# EAGLE design rf24-prueba12-F (EAGLE 9.6.2)
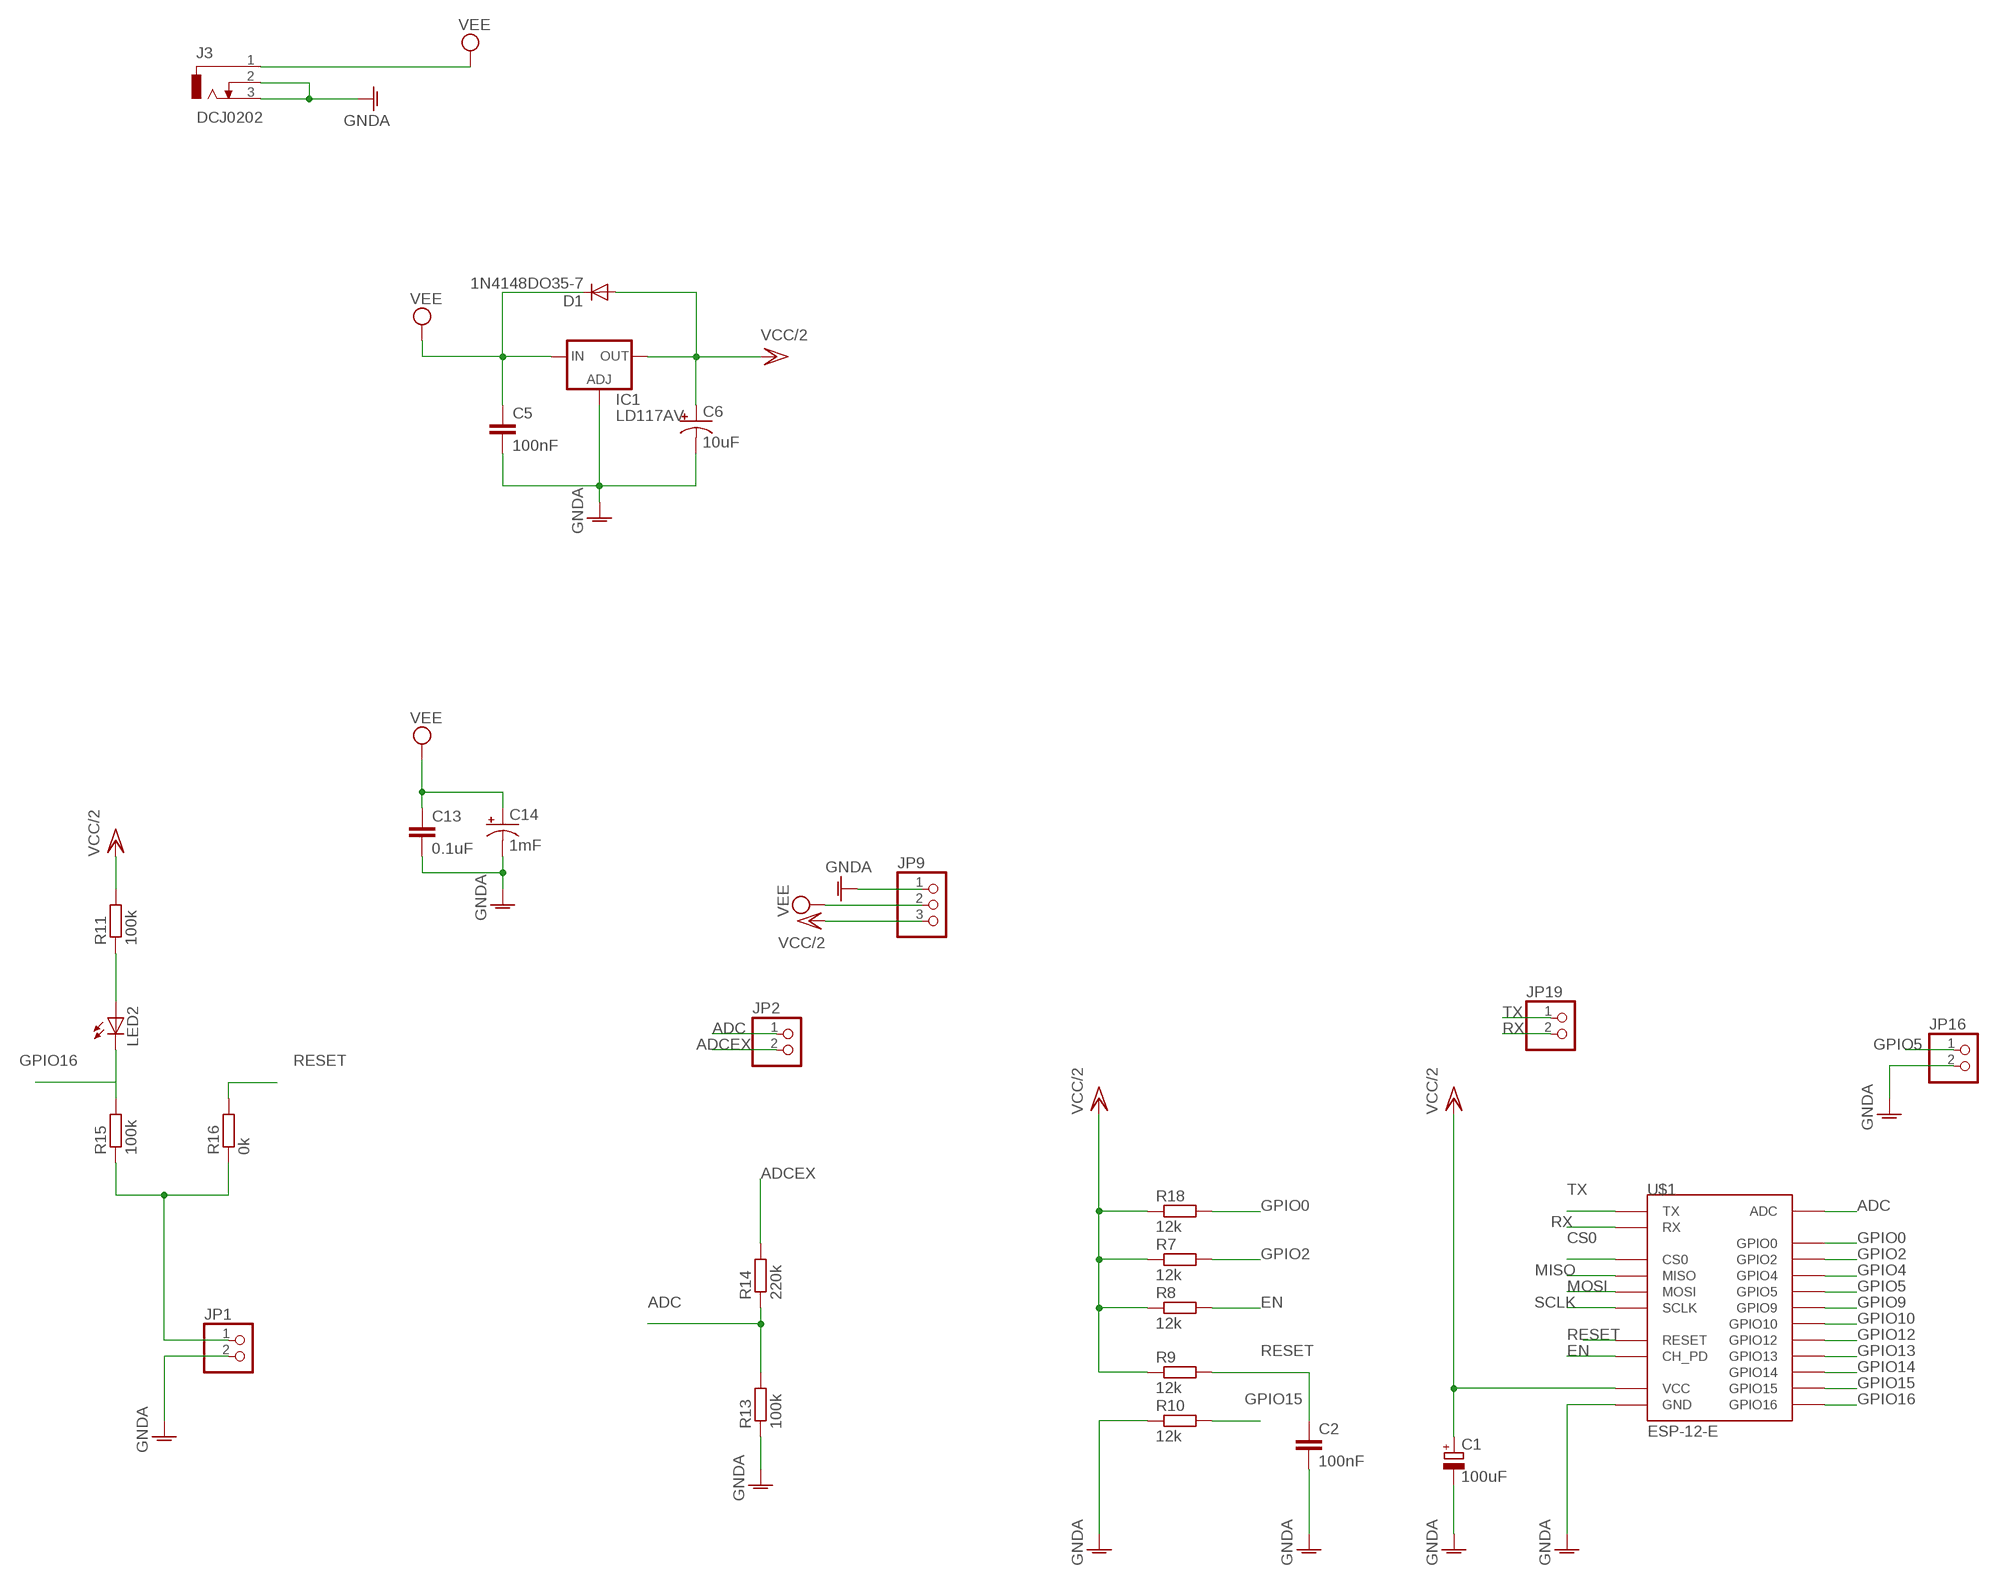
[diagram p0: schematic, sheet 1, part 1 of 2]
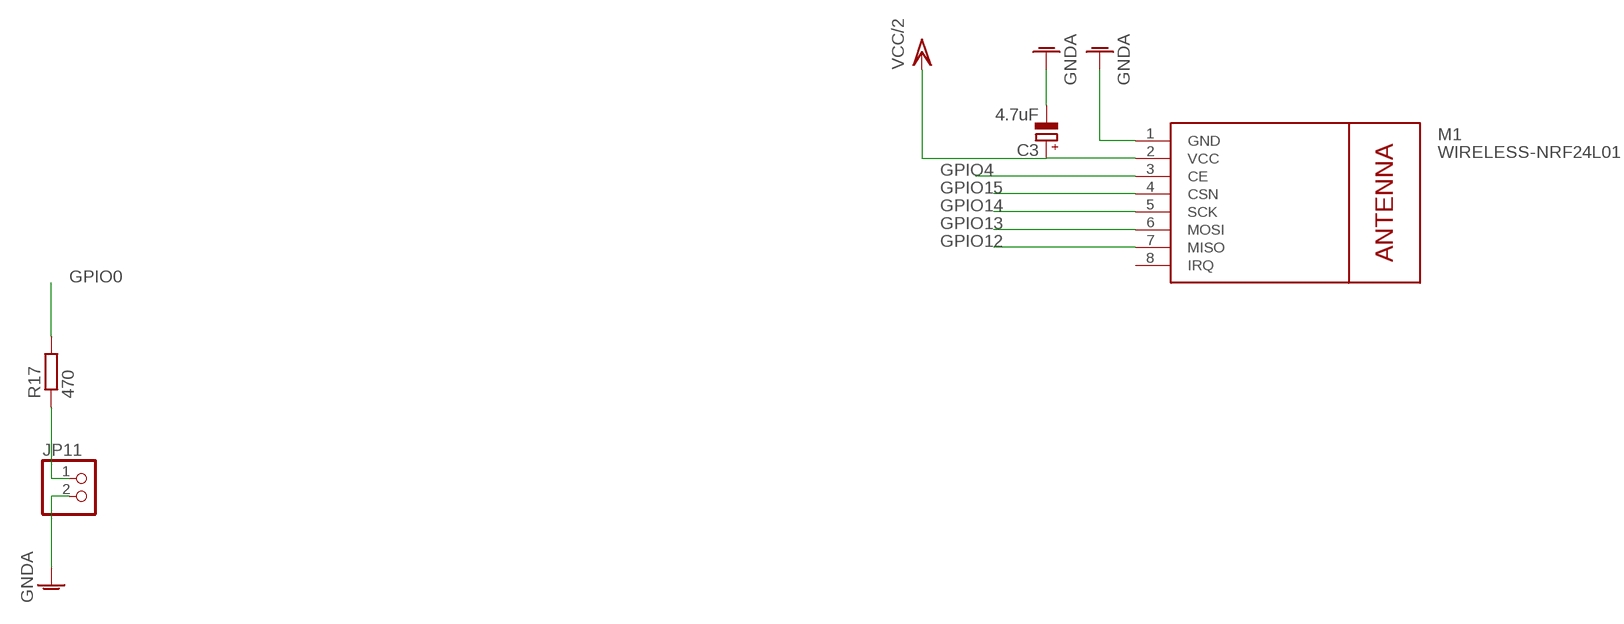
[diagram p1: schematic, sheet 1, part 2 of 2]

## Parts
C1  100uF  CPOL-EUTT5D7  [TT5D7]
C2  100nF  C-EU025-024X044  [C025-024X044]
C3  4.7uF  CPOL-EUTT5D7  [TT5D7]
C5  100nF  C-EU025-025X050  [C025-025X050]
C6  10uF  CPOL-USE2,5-6E  [E2,5-6E]
C13  0.1uF  C-EU025-025X050  [C025-025X050]
C14  1mF  CPOL-USE2,5-6E  [E2,5-6E]
D1  1N4148DO35-7  [DO35-7]
IC1  LD117AV  [TO220L1]
J3  DCJ0202  [DCJ0202]
JP1  PINHD-1X2  [1X02]
JP2  PINHD-1X2  [1X02]
JP9  PINHD-1X3  [1X03]
JP11  PINHD-1X2  [1X02]
JP16  PINHD-1X2  [1X02]
JP19  PINHD-1X2  [1X02]
LED2  LED3MM  [LED3MM]
M1  WIRELESS-NRF24L01  [WIRELESS-NRF24L01]
R7  12k  R-EU_0207/7  [0207/7]
R8  12k  R-EU_0207/7  [0207/7]
R9  12k  R-EU_0207/7  [0207/7]
R10  12k  R-EU_0207/7  [0207/7]
R11  100k  R-EU_0207/7  [0207/7]
R13  100k  R-EU_0207/7  [0207/7]
R14  220k  R-EU_0207/7  [0207/7]
R15  100k  R-EU_0207/7  [0207/7]
R16  0k  R-EU_0207/7  [0207/7]
R17  470  R-EU_0207/7  [0207/7]
R18  12k  R-EU_0207/7  [0207/7]
U$1  ESP-12-E  [ESP-12-E]

## Nets
ADC: JP2.1 R13.2 R14.1 U$1.ADC
ADCEX: JP2.2 R14.2
CS0: U$1.CS0
EN: R8.2 U$1.CH_PD
GNDA: C1.- C2.2 C3.- C5.2 C6.- C13.2 C14.- IC1.1(ADJ) J3.2 J3.3 JP1.2 JP9.1 JP11.2 JP16.2 M1.1(GND) R10.1 R13.1 U$1.GND
GPIO0: R17.2 R18.2 U$1.GPIO0
GPIO2: R7.2 U$1.GPIO2
GPIO4: M1.3(CE) U$1.GPIO4
GPIO5: JP16.1 U$1.GPIO5
GPIO9: U$1.GPIO9
GPIO10: U$1.GPIO10
GPIO12: M1.7(MISO) U$1.GPIO12
GPIO13: M1.6(MOSI) U$1.GPIO13
GPIO14: M1.5(SCK) U$1.GPIO14
GPIO15: M1.4(CSN) R10.2 U$1.GPIO15
GPIO16: LED2.K(C) R15.2 U$1.GPIO16
MISO: U$1.MISO
MOSI: U$1.MOSI
N$13: JP11.1 R17.1
N$22: LED2.A R11.1
N$26: JP1.1 R15.1 R16.1
RESET: C2.1 R9.2 R16.2 U$1.RESET
RX: JP19.2 U$1.RX
SCLK: U$1.SCLK
TX: JP19.1 U$1.TX
VCC/2: C1.+ C3.+ C6.+ D1.A IC1.2(OUT) JP9.3 M1.2(VCC) R7.1 R8.1 R9.1 R11.2 R18.1 U$1.VCC
VEE: C5.1 C13.1 C14.+ D1.C IC1.3(IN) J3.1 JP9.2
Unconnected: M1.8(IRQ)

## Library data of the parts
C1 C3 = resistor:CPOL-EU: POLARIZED CAPACITOR, European symbol
C2 C5 C13 = rcl:C-EU: CAPACITOR, European symbol
C6 C14 = rcl:CPOL-US: POLARIZED CAPACITOR, American symbol
D1 = diode:1N4148: DIODE high speed (Philips)
IC1 = v-reg:LD117A?*: Low drop fixed and adjustable positive voltage regulators 1 A Source: http://www.st.com/stonline/products/literature/ds/7194/ld1117axx.pdf
J3 = con-jack:DCJ0202: DC POWER JACK Source: DCJ0202.pdf; OC_FARNELL: unknown; OC_NEWARK: unknown
JP1 JP2 JP11 JP16 JP19 = pinhead:PINHD-1X2: PIN HEADER
JP9 = pinhead:PINHD-1X3: PIN HEADER
LED2 = led:LED: LED OSRAM: - CHIPLED LG R971, LG N971, LY N971, LG Q971, LY Q971, LO R971, LY R971 LH N974, LH R974 LS Q976, LO Q976, LY Q976 LO Q996 - Hyper CHIPLED LW Q18S LB Q993, LB Q99A, LB R99A - SideLED LS A670, LO A670, LY A670, LG A670, LP A670 LB A673, LV A673, LT A673, LW A673 LH A674 LY A675 LS A676, LA A676, LO A676, LY A676, LW A676 LS A679, LY A679, LG A679 - Hyper Micro SIDELED® LS Y876, LA Y876, LO Y876, LY Y876 LT Y87S - SmartLED LW L88C, LW L88S LB L89C, LB L89S, LG L890 LS L89K, LO L89K, LY L89K LS L896, LA L896, LO L896, LY L896 - TOPLED LS T670, LO T670, LY T670, LG T670, LP T670 LSG T670, LSP T670, LSY T670, LOP T670, LYG T670 LG T671, LOG T671, LSG T671 LB T673, LV T673, LT T673, LW T673 LH T674 LS T676, LA T676, LO T676, LY T676, LB T676, LH T676, LSB T676, LW T676 LB T67C, LV T67C, LT T67C, LS T67K, LO T67K, LY T67K, LW E67C LS E67B, LA E67B, LO E67B, LY E67B, LB E67C, LV E67C, LT E67C LW T67C LS T679, LY T679, LG T679 LS T770, LO T770, LY T770, LG T770, LP T770 LB T773, LV T773, LT T773, LW T773 LH T774 LS E675, LA E675, LY E675, LS T675 LS T776, LA T776, LO T776, LY T776, LB T776 LHGB T686 LT T68C, LB T68C - Hyper Mini TOPLED® LB M676 - Mini TOPLED Santana® LG M470 LS M47K, LO M47K, LY M47K Source: http://www.osram.convergy.de LUXEON: - LUMILED® LXK2-PW12-R00, LXK2-PW12-S00, LXK2-PW14-U00, LXK2-PW14-V00 LXK2-PM12-R00, LXK2-PM12-S00, LXK2-PM14-U00 LXK2-PE12-Q00, LXK2-PE12-R00, LXK2-PE12-S00, LXK2-PE14-T00, LXK2-PE14-U00 LXK2-PB12-K00, LXK2-PB12-L00, LXK2-PB12-M00, LXK2-PB14-N00, LXK2-PB14-P00, LXK2-PB14-Q00 LXK2-PR12-L00, LXK2-PR12-M00, LXK2-PR14-Q00, LXK2-PR14-R00 LXK2-PD12-Q00, LXK2-PD12-R00, LXK2-PD12-S00 LXK2-PH12-R00, LXK2-PH12-S00 LXK2-PL12-P00, LXK2-PL12-Q00, LXK2-PL12-R00 Source: www.luxeon.com KINGBRIGHT: KA-3528ASYC Source: www.kingbright.com
M1 = diy-modules:WIRELESS-NRF24L01: 2.4 GHz Wireless Module based on NRF24L01 chip More details available here: http://www.electrodragon.com/w/NRF24L01 Click here to find device on ebay.com <http://www.ebay.com/sch/nrf24l01+arduino>
R7-R11 R13-R18 = resistor:R-EU_: RESISTOR, European symbol
U$1 = johs_esp8266_lib_frank_esp12e_mod:ESP-12-E: ESP8266 Wifi Module ESP-12-E; DIMENSIONS: 24.0 x 16.0 mm; PINS: 22; PITCH: 0.078" / 2 mm; SPICEPREFIX: X

## Net classes
1 power: width 1.016 mm

## Board
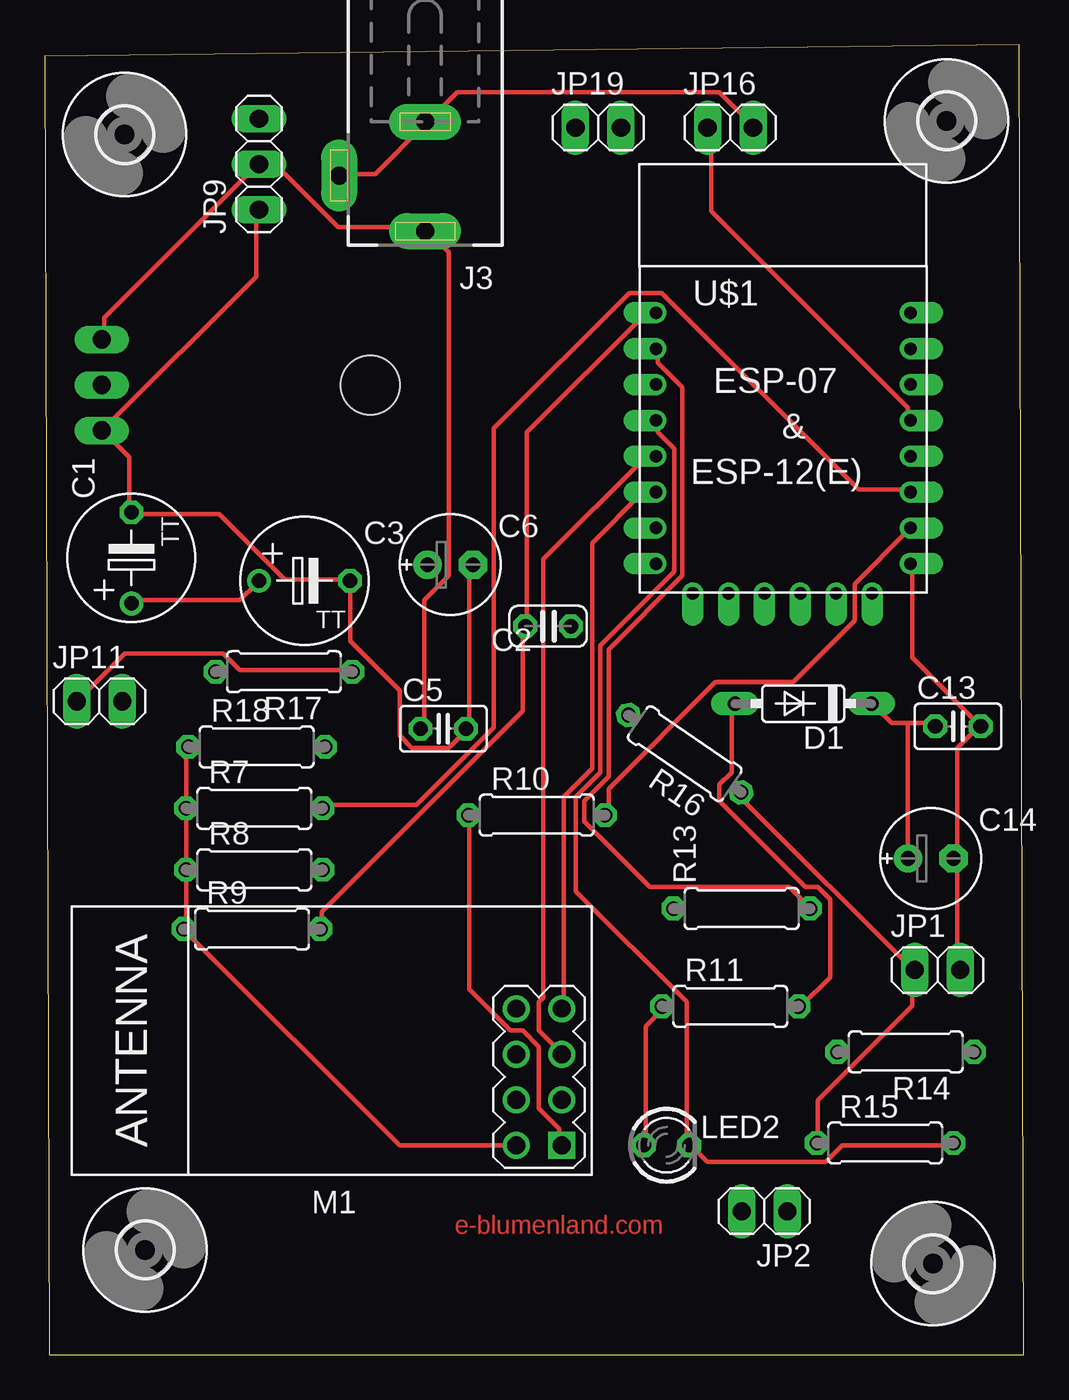
[diagram p2: board, top side]
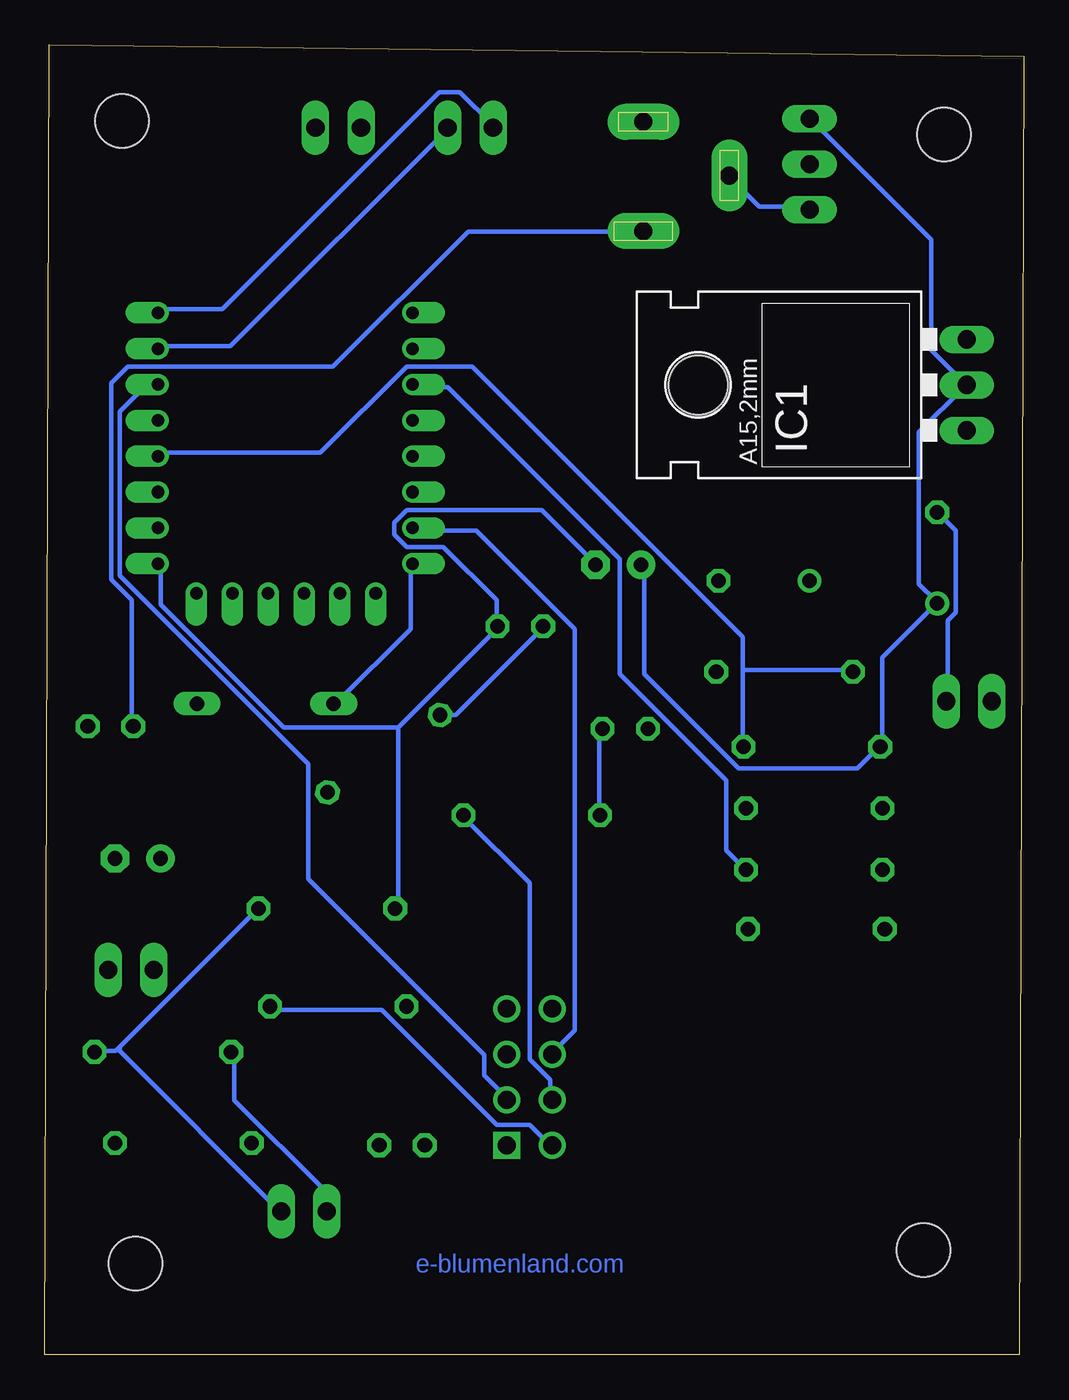
[diagram p3: board, bottom side, seen from below]

Size 54.59 x 73.08 mm. Coordinates in mm from the lower left corner, seen from the top.
Outline: 0.25,0 54.59,0 54.34,73.08 0,72.44 0.25,0
Copper layers (1*16): Top 0.035mm / dielectric 1.5mm / Bottom 0.035mm
Design rules "default *": minimum track width 10mil, minimum drill 16mil, track to track 8mil, track to pad 8mil, pad to pad 8mil, via to via 8mil, smd to smd 8mil, copper to edge 40mil, drill to drill 8mil, minimum pad ring 10mil, minimum via ring 8mil, stop-mask expansion 4mil, vias tented up to drill 0mil, thermal gap 10mil

### Footprints (pad centres in the part's own frame; a part is rotated, then mirrored left to right if it is on the bottom)
TT5D7 = drill 0.813: + -2.54,0 | drill 0.813 octagon: - 2.54,0
C025-024X044 = drill 0.813 octagon: 1 -1.27,0; 2 1.27,0
C025-025X050 = drill 0.813 octagon: 1 -1.27,0; 2 1.27,0
E2,5-6E = drill 0.813 pad 1.575: + -1.27,0 | drill 0.813 pad 1.575 octagon: - 1.27,0
DO35-7 = drill 0.813 long: A 3.81,0; C -3.81,0
3,0 = hole 3: 0,0
TO220L1 = drill 1.016 long: 1 -2.54,-3.81; 2 0,-3.81; 3 2.54,-3.81 | hole 3.302: 0,11.176
DCJ0202 = drill 1 pad 2 long: 1 0,3.1; 2 4.8,0; 3 0,-3
1X02 = drill 1.016 long: 1 -1.27,0; 2 1.27,0
1X03 = drill 1.016 long: 1 -2.54,0; 2 0,0; 3 2.54,0
LED3MM = drill 0.813 octagon: A -1.27,0; K 1.27,0
WIRELESS-NRF24L01 = drill 1 square: 1 -12.7,6.35 | drill 1: 2 -10.16,6.35; 3 -12.7,3.81; 4 -10.16,3.81; 5 -12.7,1.27; 6 -10.16,1.27; 7 -12.7,-1.27; 8 -10.16,-1.27
0207/7 = drill 0.813 octagon: 1 -3.81,0; 2 3.81,0
ESP-12-E = drill 0.7 offset: ADC -7.2,3.8; CH_PD -7.2,1.8; CS0 -5.14,-9.838; GND 7,-8.2; GPIO0 7,-2.2; GPIO2 7,-4.2; GPIO4 7,1.8; GPIO5 7,-0.2; GPIO9 -1.14,-9.838; GPIO10 0.86,-9.838; GPIO12 -7.2,-4.2; GPIO13 -7.2,-6.2; GPIO14 -7.2,-2.2; GPIO15 7,-6.2; GPIO16 -7.2,-0.2; MISO -3.14,-9.838; MOSI 2.86,-9.838; RESET -7.2,5.8; RX 7,3.8; SCLK 4.86,-9.838; TX 7,5.8; VCC -7.2,-8.2

### Placement (x,y rotation side)
C1  4.83,44.45 90 top
C2  28.07,40.64 0 top
C3  14.48,43.18 0 top
C5  22.23,34.92 0 top
C6  22.61,44.07 0 top
C13  50.93,35.05 0 top
C14  49.4,27.69 0 top
D1  42.29,36.32 180 top
H1  MOUNT-HOLE3.0  [3,0]  4.45,68.07 0 top
H2  MOUNT-HOLE3.0  [3,0]  50.29,68.83 0 top
H7  MOUNT-HOLE3.0  [3,0]  5.59,5.84 0 top
H8  MOUNT-HOLE3.0  [3,0]  49.53,5.08 90 top
IC1  6.98,54.1 90 bottom
J3  21.21,65.79 180 top
JP1  49.78,21.46 0 top
JP2  40.13,8 180 top
JP9  11.94,66.42 90 top
JP11  3.05,36.45 0 top
JP16  38.23,68.45 0 top
JP19  30.86,68.45 0 top
LED2  34.67,11.68 0 top
M1  16.13,18.03 180 top
R7  11.68,30.48 0 top
R8  11.68,27.05 0 top
R9  11.56,23.75 0 top
R10  27.43,30.1 0 top
R11  38.23,19.43 0 top
R13  38.86,24.89 0 top
R14  48.01,16.89 180 top
R15  46.86,11.81 0 top
R16  35.69,33.53 145.5 top
R17  13.34,38.1 180 top
R18  11.81,33.91 0 top
U$1  41.28,52.32 0 top

### Tracks (layer width: path | path; a pad name or v marks a point on that pad's centre or on a via)
ADC
  Top 0.254: U$1.ADC 34.19,56.03 34.19,55.35 35.56,53.98 35.56,43.46 31.45,39.34 31.45,32.26 30.07,30.89 30.07,29.74 33.73,26.09 41.5,26.09 42.65,24.94 R13.2
  Bottom 0.254: 50.42,17.17 42.88,24.71 R13.2 | 50.42,17.17 50.65,16.94 51.79,16.94 R14.1 | 50.42,17.17 50.42,16.94 41.5,8.03 JP2.1
ADCEX
  Bottom 0.254: R14.2 44.02,16.71 44.02,14.2 38.99,9.17 38.99,8.03 JP2.2
EN
  Bottom 0.254: R8.2 16.59,28.14 16.59,32.03 22.53,37.97 22.53,44.37 32.13,53.98 33.96,53.98 U$1.CH_PD
GNDA
  Top 0.254: 50.88,27.69 50.88,21.51 JP1.2 | U$1.GND 48.36,43.92 48.36,38.89 C13.2 52.02,35 50.88,33.86 50.88,27.69 | 50.88,27.69 C14.- | JP16.2 39.45,68.61 37.62,70.43 22.99,70.43 21.39,68.83 J3.3 21.16,68.61 18.42,65.86 16.59,65.86 J3.2 | M1.1 28.7,11.68 28.7,12.6 27.56,13.74 27.56,17.17 26.65,18.09 25.96,18.09 23.67,20.37 23.67,29.97 R10.1 | C6.- 23.67,43.92 23.67,35 C5.2 23.44,34.77 22.53,33.86 20.47,33.86 19.79,34.54 19.79,37.06 17.04,39.8 17.04,43 C3.- 16.81,43.23 13.39,43.23 9.73,46.89 4.93,46.89 C1.- 4.7,47.12 4.7,50.09 3.33,51.46 IC1.1 3.33,51.69 11.79,60.15 11.79,63.8 JP9.1
  Bottom 0.254: 34.87,35 34.87,24.94 R13.1 | 34.87,35 29.39,40.49 C2.2 29.39,40.72 29.39,42.09 32.36,45.06 34.42,45.06 35.1,45.75 35.1,46.43 34.42,47.12 26.87,47.12 23.9,44.14 C6.- | 34.87,35 41.28,35 48.13,41.86 48.13,43.92 U$1.GND | JP9.1 12.01,64.03 14.76,64.03 16.36,65.63 J3.2 | JP11.2 4.24,36.6 4.24,40.95 3.79,41.4 3.79,45.97 4.7,46.89 C1.- | C5.2 23.67,34.77 23.67,30.2 R10.1
GPIO0
  Bottom 0.254: 15.67,38.2 15.67,34.09 R18.2 | 15.67,38.2 15.67,40.03 30.76,55.12 34.42,55.12 39.22,50.32 48.13,50.32 U$1.GPIO0 | 15.67,38.2 9.73,38.2 R17.2
GPIO2
  Top 0.254: U$1.GPIO2 48.13,48.26 45.39,48.26 34.42,59.23 32.59,59.23 25.04,51.69 25.04,35 20.7,30.66 15.67,30.66 R7.2
GPIO4
  Bottom 0.254: U$1.GPIO4 48.36,53.98 49.05,53.98 50.42,52.6 50.42,43.46 39.9,32.94 39.9,26.54 30.07,16.71 30.07,15.57 28.93,14.43 M1.3
GPIO5
  Top 0.254: U$1.GPIO5 48.13,52.15 48.13,52.83 37.16,63.8 37.16,68.38 JP16.1
GPIO12
  Top 0.254: U$1.GPIO12 33.96,48.03 33.27,48.03 30.53,45.29 30.53,32.72 28.93,31.12 28.93,19.46 M1.7
GPIO13
  Bottom 0.254: U$1.GPIO13 33.96,45.97 30.53,45.97 25.04,40.49 25.04,18.09 26.19,16.94 M1.6
GPIO14
  Top 0.254: U$1.GPIO14 33.96,50.09 33.5,50.09 27.79,44.37 27.79,19.91 27.56,19.69 27.56,18.09 28.7,16.94 M1.5
GPIO15
  Top 0.254: U$1.GPIO15 48.13,45.97 45.16,43 45.16,40.95 41.73,37.52 37.39,37.52 31.45,31.57 31.45,30.2 R10.2
  Bottom 0.254: M1.4 26.42,14.43 26.42,15.34 27.56,16.48 27.56,26.31 31.22,29.97 R10.2
GPIO16
  Top 0.254: U$1.GPIO16 34.19,51.92 34.19,51.46 35.1,50.55 35.1,43.69 30.99,39.57 30.99,32.49 29.62,31.12 29.62,25.86 35.79,19.69 35.79,11.68 LED2.K 36.02,11.68 36.93,10.77 43.56,10.77 44.48,11.68 50.65,11.68 R15.2
N$13
  Top 0.254: R17.1 17.04,38.2 10.87,38.2 9.96,39.12 4.47,39.12 1.96,36.6 JP11.1
N$22
  Top 0.254: LED2.A 33.5,11.68 33.5,18.31 34.42,19.23 R11.1
N$26
  Top 0.254: R15.1 43.1,11.91 43.1,14.2 48.36,19.46 48.36,21.28 JP1.1 48.36,21.51 38.99,30.89 38.99,31.34 R16.1
RESET
  Top 0.254: U$1.RESET 33.96,58.09 33.5,58.09 26.87,51.46 26.87,40.72 C2.1 26.65,40.49 26.65,35.92 15.44,24.71 15.44,23.8 R9.2
  Bottom 0.254: R16.2 32.36,35.69 31.67,35.69 26.87,40.49 C2.1
RX
  Bottom 0.254: U$1.RX 48.13,56.26 44.25,56.26 32.13,68.38 JP19.2
TX
  Bottom 0.254: U$1.TX 48.13,58.32 44.7,58.32 32.59,70.43 31.45,70.43 29.62,68.61 JP19.1
VCC/2
  Top 0.254: D1.A 38.3,36.14 38.3,32.49 37.62,31.8 37.62,30.89 42.42,26.09 43.1,26.09 43.79,25.4 43.79,21.06 42.19,19.46 R11.2 | R18.1 7.9,33.86 7.9,30.66 R7.1 7.9,30.43 7.9,27.23 R8.1 7.9,27 7.9,23.8 R9.1 7.9,23.57 19.79,11.68 M1.2 | C1.+ 4.93,42.09 10.87,42.09 11.79,43 C3.+
  Bottom 0.254: U$1.VCC 34.19,43.92 34.19,40.49 38.3,36.37 D1.A | R11.2 41.96,19.23 35.79,19.23 29.39,12.83 27.56,12.83 26.42,11.68 M1.2 | C6.+ 21.16,43.92 21.16,37.97 15.9,32.72 9.27,32.72 8.13,33.86 R18.1 7.9,34.09 7.9,38.89 4.93,41.86 C1.+ 4.93,42.09 5.84,43 5.84,51.46 3.33,53.98 IC1.2 3.33,54.2 5.16,56.03 5.16,62.2 11.79,68.83 JP9.3
VEE
  Top 0.254: IC1.3 3.33,56.72 3.33,57.86 11.79,66.32 JP9.2 12.01,66.32 12.93,66.32 16.36,62.89 21.16,62.89 J3.1 21.39,62.66 22.53,61.52 22.53,43.46 21.16,42.09 21.16,35 C5.1 | 48.13,35.23 47.22,35.23 46.3,36.14 D1.C | 48.13,35.23 49.51,35.23 C13.1 | 48.13,35.23 C14.+
  Bottom 0.254: C13.1 49.73,35.23 49.73,42.09 50.88,43.23 50.88,54.2 49.96,55.12 38.53,55.12 30.99,62.66 21.39,62.66 J3.1

### Text on the board
Top: e-blumenland.com
Bottom: e-blumenland.com